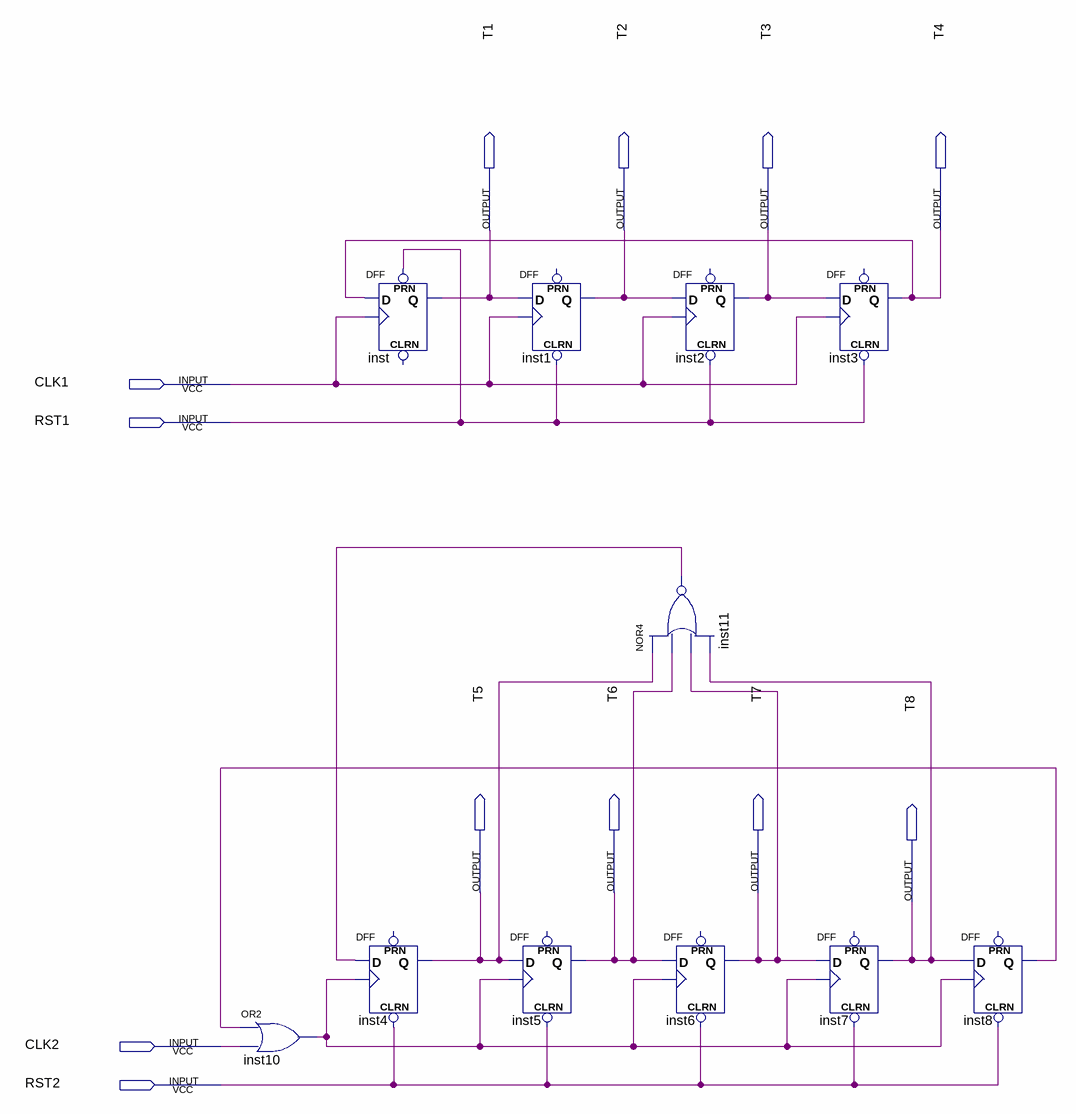
[diagram p0: schematic sheet]
// Quartus schematic prj7.bdf as structural Verilog: 11 symbols, 12 pins
module prj7 (
  input  CLK1,
  input  RST1,
  input  CLK2,
  input  RST2,
  output T1,
  output T2,
  output T3,
  output T4,
  output T5,
  output T6,
  output T7,
  output T8
);

  wire inst8_q, inst10_out, inst11_out;

  or inst10 (inst10_out, inst8_q, CLK2);
  DFF inst (.CLK(CLK1), .D(T4), .PRN(RST1), .Q(T1));  // open: CLRN
  DFF inst4 (.CLRN(RST2), .CLK(inst10_out), .D(inst11_out), .Q(T5));  // open: PRN
  DFF inst1 (.CLRN(RST1), .CLK(CLK1), .D(T1), .Q(T2));  // open: PRN
  DFF inst5 (.CLRN(RST2), .CLK(inst10_out), .D(T5), .Q(T6));  // open: PRN
  nor inst11 (inst11_out, T5, T6, T7, T8);
  DFF inst2 (.CLRN(RST1), .CLK(CLK1), .D(T2), .Q(T3));  // open: PRN
  DFF inst6 (.CLRN(RST2), .CLK(inst10_out), .D(T6), .Q(T7));  // open: PRN
  DFF inst3 (.CLRN(RST1), .CLK(CLK1), .D(T3), .Q(T4));  // open: PRN
  DFF inst7 (.CLRN(RST2), .CLK(inst10_out), .D(T7), .Q(T8));  // open: PRN
  DFF inst8 (.CLRN(RST2), .CLK(inst10_out), .D(T8), .Q(inst8_q));  // open: PRN
endmodule
